# Altium schematic sheet Main_Schematics.SchDoc
size A4; SheetNumber: 1; SheetTotal: 10
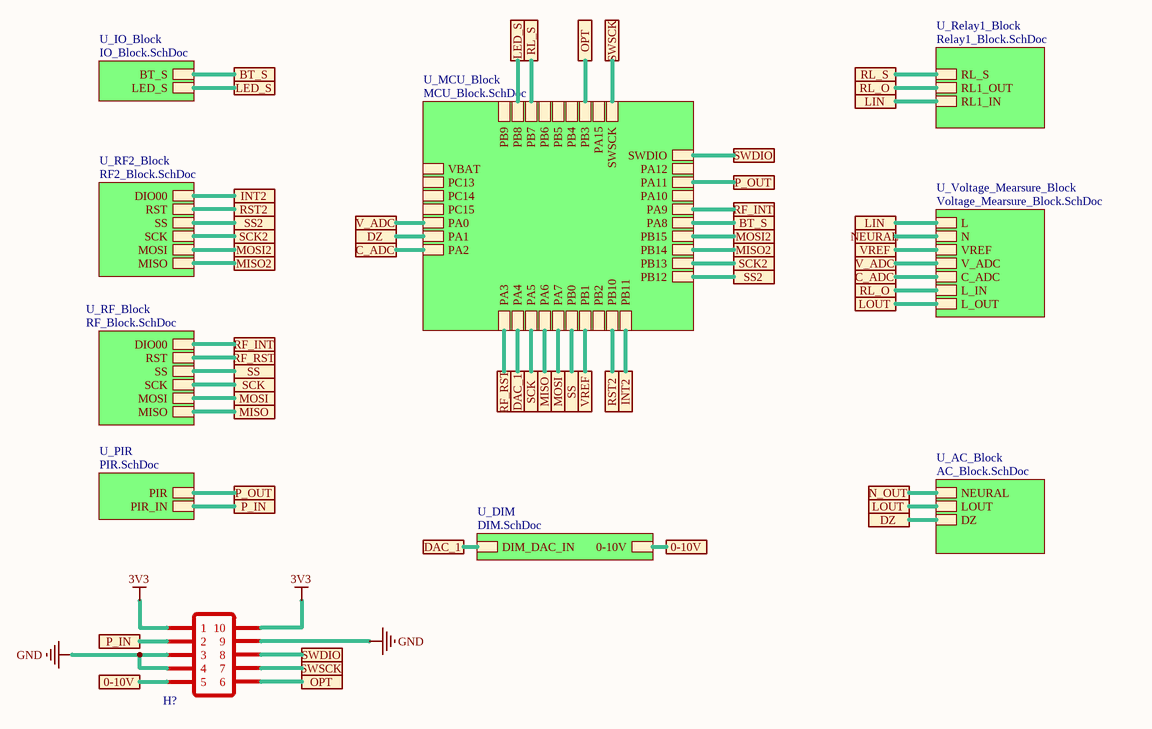
[diagram p0: Main_Schematics.SchDoc]

## Parts
H?  HDR-F-2.54-2x5  [HDR-M-2.54-2X5P]  (value not drawn)

## Sub-sheets
U_AC_Block = AC_Block.SchDoc: NEURAL, LOUT, DZ
U_DIM = DIM.SchDoc: DIM_DAC_IN, 0-10V
U_IO_Block = IO_Block.SchDoc: LED_S, BT_S
U_MCU_Block = MCU_Block.SchDoc: SWDIO, SWSCK, PA12, PA11, PA10, PA9, PA8, PB15, PB14, PB13, PB12, PB11, PB10, PB2, PB1, PB0, PA7, PA6, PA5, PA4, PA3, PA15, PB3, PB4, PB5, PB6, PB7, PB8, PB9, VBAT, PC13, PC14, PC15, PA0, PA1, PA2
U_PIR = PIR.SchDoc: PIR_IN, PIR
U_Relay1_Block = Relay1_Block.SchDoc: RL_S, RL1_OUT, RL1_IN
U_RF2_Block = RF2_Block.SchDoc: MISO, MOSI, SCK, SS, RST, DIO00
U_RF_Block = RF_Block.SchDoc: MISO, MOSI, SCK, SS, RST, DIO00
U_Voltage_Mearsure_Block = Voltage_Mearsure_Block.SchDoc: L, N, VREF, V_ADC, C_ADC, L_IN, L_OUT

## Ports
0-10V, BT_S, C_ADC, DAC_1, DZ, INT2, LED_S, LIN, LOUT, MISO, MISO2, MOSI, MOSI2, N_OUT, NEURAL, OPT, P_IN, P_OUT, RF_INT, RF_RST, RL_O, RL_S, RST2, SCK, SCK2, SS, SS2, SWDIO, SWSCK, V_ADC, VREF

## Nets
3V3: H?.1 H?.10
GND: H?.3 H?.4 H?.9
0-10V: H?.5 ; port 0-10V, sheet U_DIM/0-10V
BT_S: port BT_S, sheet U_MCU_Block/PA8, sheet U_IO_Block/BT_S
C_ADC: port C_ADC, sheet U_MCU_Block/PA2, sheet U_Voltage_Mearsure_Block/C_ADC
DAC_1: port DAC_1, sheet U_MCU_Block/PA4, sheet U_DIM/DIM_DAC_IN
DZ: port DZ, sheet U_MCU_Block/PA1, sheet U_AC_Block/DZ
INT2: port INT2, sheet U_MCU_Block/PB11, sheet U_RF2_Block/DIO00
LED_S: port LED_S, sheet U_MCU_Block/PB8, sheet U_IO_Block/LED_S
LIN: port LIN, sheet U_Relay1_Block/RL1_IN, sheet U_Voltage_Mearsure_Block/L
LOUT: port LOUT, sheet U_AC_Block/LOUT, sheet U_Voltage_Mearsure_Block/L_OUT
MISO: port MISO, sheet U_MCU_Block/PA6, sheet U_RF_Block/MISO
MISO2: port MISO2, sheet U_MCU_Block/PB14, sheet U_RF2_Block/MISO
MOSI: port MOSI, sheet U_MCU_Block/PA7, sheet U_RF_Block/MOSI
MOSI2: port MOSI2, sheet U_MCU_Block/PB15, sheet U_RF2_Block/MOSI
N_OUT: port N_OUT, sheet U_AC_Block/NEURAL
NEURAL: port NEURAL, sheet U_Voltage_Mearsure_Block/N
OPT: H?.6 ; port OPT, sheet U_MCU_Block/PB3
P_IN: H?.2 ; port P_IN, sheet U_PIR/PIR_IN
P_OUT: port P_OUT, sheet U_MCU_Block/PA11, sheet U_PIR/PIR
RF_INT: port RF_INT, sheet U_MCU_Block/PA9, sheet U_RF_Block/DIO00
RF_RST: port RF_RST, sheet U_MCU_Block/PA3, sheet U_RF_Block/RST
RL_O: port RL_O, sheet U_Relay1_Block/RL1_OUT, sheet U_Voltage_Mearsure_Block/L_IN
RL_S: port RL_S, sheet U_MCU_Block/PB7, sheet U_Relay1_Block/RL_S
RST2: port RST2, sheet U_MCU_Block/PB10, sheet U_RF2_Block/RST
SCK: port SCK, sheet U_MCU_Block/PA5, sheet U_RF_Block/SCK
SCK2: port SCK2, sheet U_MCU_Block/PB13, sheet U_RF2_Block/SCK
SS: port SS, sheet U_MCU_Block/PB0, sheet U_RF_Block/SS
SS2: port SS2, sheet U_MCU_Block/PB12, sheet U_RF2_Block/SS
SWDIO: H?.8 ; port SWDIO, sheet U_MCU_Block/SWDIO
SWSCK: H?.7 ; port SWSCK, sheet U_MCU_Block/SWSCK
V_ADC: port V_ADC, sheet U_MCU_Block/PA0, sheet U_Voltage_Mearsure_Block/V_ADC
VREF: port VREF, sheet U_MCU_Block/PB1, sheet U_Voltage_Mearsure_Block/VREF

## Notes on the sheet
- Title
- Size:
- Date:
- A4
- Number:
- Time:
- Revision:
- Design by:
- Company:
- File:

## Library data of the parts
H? = HDR-F-2.54-2x5: Connector HDR-2.54 2x5 Pole